# EAGLE schematic soundmeter (EAGLE 7.6.0)
CNAME: Sound Meter; CREVISION: A; DESIGNER: Warwick Hunter
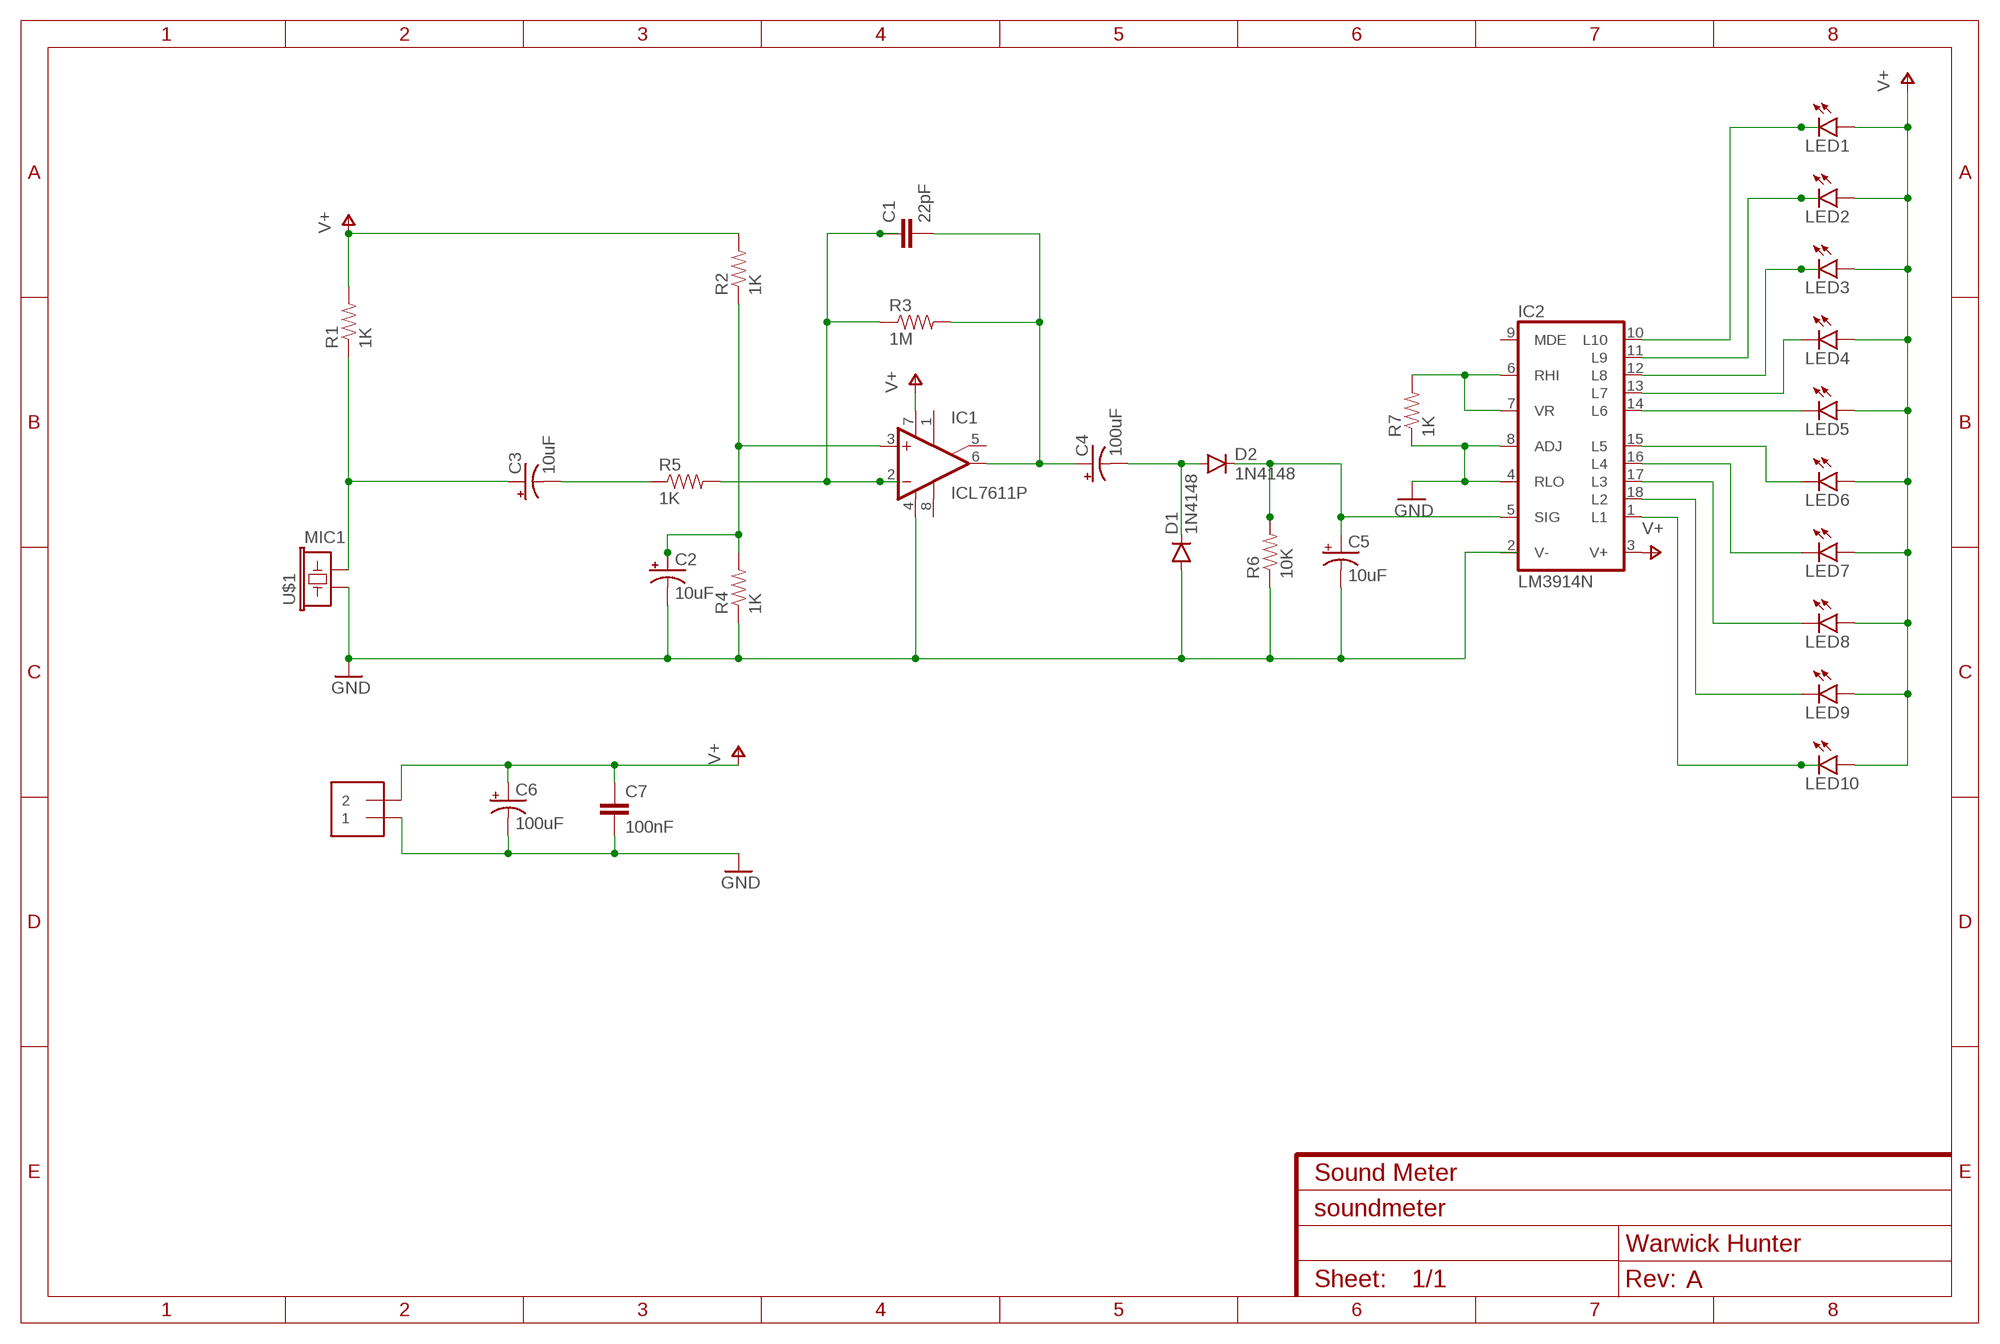
[diagram p0: schematic, sheet 1]

## Parts
C1  22pF  CAPPTH  [CAP-PTH-SMALL]
C2  10uF  CAP_POLPTH2  [CPOL-RADIAL-10UF-25V]
C3  10uF  CAP_POLPTH2  [CPOL-RADIAL-10UF-25V]
C4  100uF  CAP_POLPTH2  [CPOL-RADIAL-10UF-25V]
C5  10uF  CAP_POLPTH2  [CPOL-RADIAL-10UF-25V]
C6  100uF  CAP_POLPTH2  [CPOL-RADIAL-10UF-25V]
C7  100nF  CAPPTH  [CAP-PTH-SMALL]
D1  1N4148  DIODE1N4148  [DIODE-1N4148]
D2  1N4148  DIODE1N4148  [DIODE-1N4148]
IC1  ICL7611P  [DIL08]
IC2  LM3914N  [DIL18]
J1  1X2-3.5MM  [1X2-3.5MM]
LED1  LED3MM  [LED3MM]
LED2  LED3MM  [LED3MM]
LED3  LED3MM  [LED3MM]
LED4  LED3MM  [LED3MM]
LED5  LED3MM  [LED3MM]
LED6  LED3MM  [LED3MM]
LED7  LED3MM  [LED3MM]
LED8  LED3MM  [LED3MM]
LED9  LED3MM  [LED3MM]
LED10  LED3MM  [LED3MM]
R1  1K  RESISTORPTH-1/4W  [AXIAL-0.4]
R2  1K  RESISTORPTH-1/4W  [AXIAL-0.4]
R3  1M  RESISTORPTH-1/4W  [AXIAL-0.4]
R4  1K  RESISTORPTH-1/4W  [AXIAL-0.4]
R5  1K  RESISTORPTH-1/4W  [AXIAL-0.4]
R6  10K  RESISTORPTH-1/4W  [AXIAL-0.4]
R7  1K  RESISTORPTH-1/4W  [AXIAL-0.4]
U$1  MIC1  MIC9.7MM  [MIC-9.7MM]

## Nets
GND [Supply]: C2.2(-) C5.2(-) C6.2(-) C7.2 D1.A IC1.4(V-) IC2.4(RLO) IC2.8(ADJ) J1.1 R4.P$1 R6.P$1 R7.P$1 U$1.1
N$1: C5.1(+) D2.C IC2.5(SIG) R6.P$2
N$3: C3.1(+) R1.P$1 U$1.2
N$4: C3.2(-) R5.P$1
N$5: C1.1 IC1.2(-IN) R3.P$1 R5.P$2
N$6: C2.1(+) IC1.3(+IN) R2.P$1 R4.P$2
N$7: IC2.6(RHI) IC2.7(VR) R7.P$2
N$8: C1.2 C4.1(+) IC1.6(OUT) R3.P$2
N$9: IC2.1(L1) LED10.K(C)
N$10: C4.2(-) D1.C D2.A
N$11: IC2.18(L2) LED9.K(C)
N$12: IC2.17(L3) LED8.K(C)
N$13: IC2.16(L4) LED7.K(C)
N$14: IC2.15(L5) LED6.K(C)
N$15: IC2.14(L6) LED5.K(C)
N$16: IC2.13(L7) LED4.K(C)
N$17: IC2.12(L8) LED3.K(C)
N$18: IC2.11(L9) LED2.K(C)
N$19: IC2.10(L10) LED1.K(C)
V+ [Supply]: C6.1(+) C7.1 IC1.7(V+) IC2.3(V+) J1.2 LED1.A LED2.A LED3.A LED4.A LED5.A LED6.A LED7.A LED8.A LED9.A LED10.A R1.P$2 R2.P$2
Unconnected: IC1.1(ON1) IC1.5(ON2) IC1.8(OPT) IC2.9(MDE)

## Power pins joined to a net without a drawn wire
V-: IC2.2(V-)

## Library data of the parts
C1 C7 = SparkFun-Capacitors:CAP: Capacitor Standard 0603 ceramic capacitor, and 0.1" leaded capacitor.
C2-C6 = SparkFun-Capacitors:CAP_POL: Capacitor Polarized These are standard SMD and PTH capacitors. Normally 10uF, 47uF, and 100uF in electrolytic and tantalum varieties. Always verify the external diameter of the through hole cap, it varies with capacity, voltage, and manufacturer. The EIA devices should be standard.
D1 D2 = SparkFun-DiscreteSemi:DIODE: Diode These are standard reverse protection diodes and small signal diodes. SMA package can handle up to about 1A. SOD-323 can handle about 200mA. What the SOD-323 package when ordering, there are some mfgs out there that are 5-pin packages.; PROD_ID: DIO-08378
IC1 = linear:ICL7611: OP AMP
IC2 = linear:LM3914N: LED DRIVER senses analog voltage levels and drives 10 LEDs
J1 = adafruit:1X2: 3.5mm Terminal block http://www.ladyada.net/library/pcb/eaglelibrary.html
LED1-LED10 = SparkFun-LED:LED: LEDs Standard schematic elements and footprints for 5mm, 3mm, 1206, and 0603 sized LEDs. 5mm - Spark Fun Electronics SKU : COM-00529 (and others); PROD_ID: DIO-08794
R1-R7 = SparkFun-Resistors:RESISTOR: Resistor Basic schematic elements and footprints for 0603, 1206, and PTH resistors.
U$1 = SparkFun-Sensors:MIC: Omni-directional electret microphone. 9.7mm standard diameter.; PROD_ID: COMP-08856